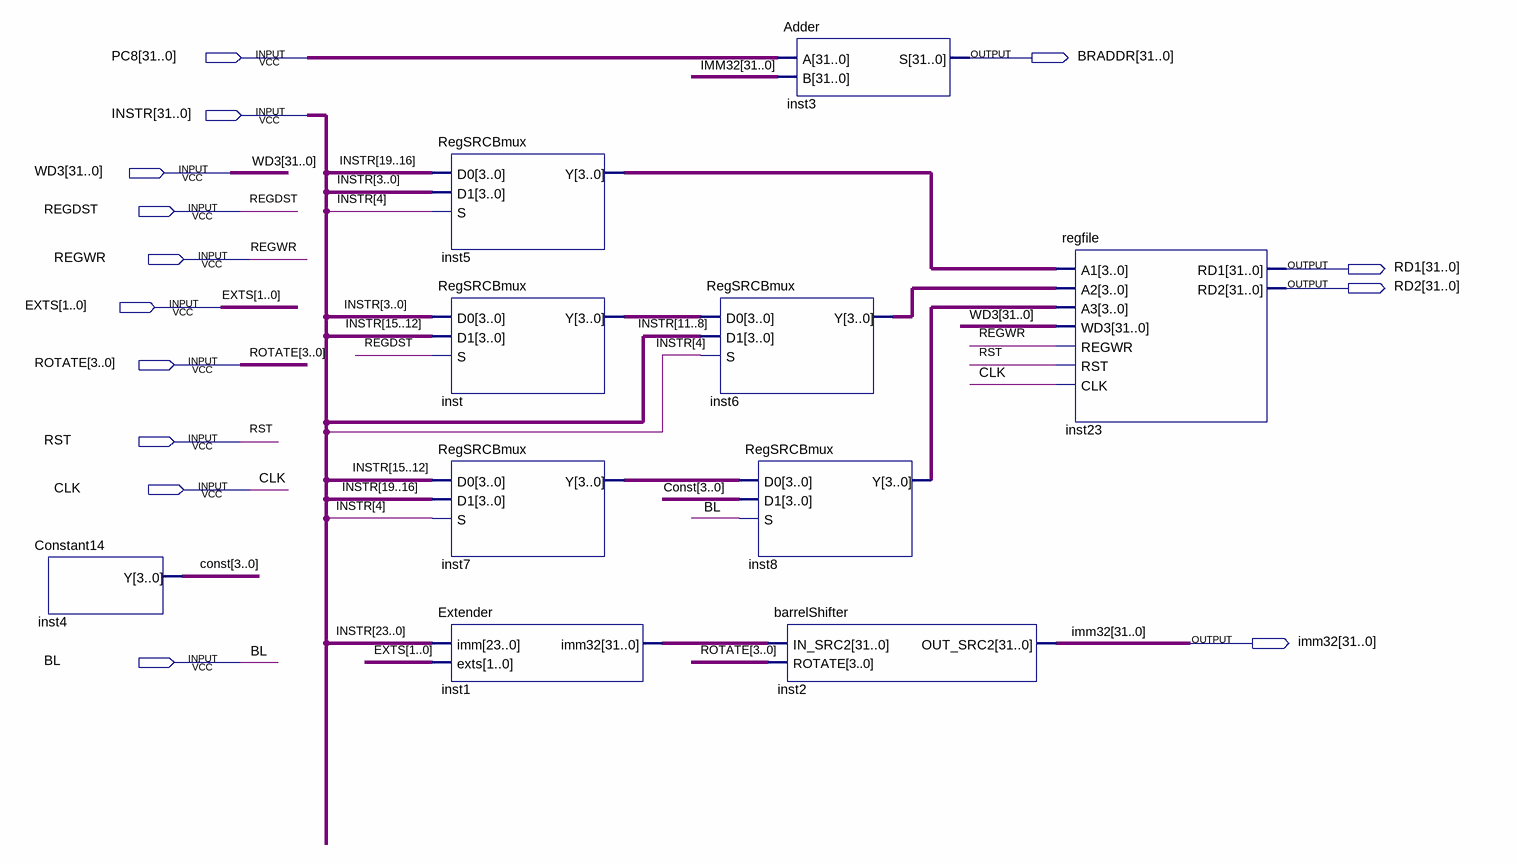
[diagram p0: schematic sheet]
// Quartus schematic Decode.bdf as structural Verilog: 10 symbols, 14 pins
module Decode (
  input  [31:0] PC8,
  input  [31:0] INSTR,
  input  [31:0] WD3,
  input  REGDST,
  input  REGWR,
  input  [1:0] EXTS,
  input  [3:0] ROTATE,
  input  RST,
  input  CLK,
  input  BL,
  output [31:0] BRADDR,
  output [31:0] RD1,
  output [31:0] RD2,
  output [31:0] imm32
);

  wire [3:0] \const , inst5_y, inst6_y, inst7_y, inst8_y, inst_y;
  wire [31:0] inst1_imm32;

  Constant14 inst4 (.Y(\const ));
  RegSRCBmux inst5 (.D0(INSTR[19:16]), .D1(INSTR[3:0]), .S(INSTR[4]), .Y(inst5_y));
  RegSRCBmux inst (.D0(INSTR[3:0]), .D1(INSTR[15:12]), .S(REGDST), .Y(inst_y));
  RegSRCBmux inst7 (.D0(INSTR[15:12]), .D1(INSTR[19:16]), .S(INSTR[4]), .Y(inst7_y));
  Extender inst1 (.imm(INSTR[23:0]), .exts(EXTS), .imm32(inst1_imm32));
  RegSRCBmux inst6 (.D0(inst_y), .D1(INSTR[11:8]), .S(INSTR[4]), .Y(inst6_y));
  RegSRCBmux inst8 (.D0(inst7_y), .D1(\const ), .S(BL), .Y(inst8_y));
  Adder inst3 (.A(PC8), .B(imm32), .S(BRADDR));
  barrelShifter inst2 (.IN_SRC2(inst1_imm32), .ROTATE(ROTATE), .OUT_SRC2(imm32));
  regfile inst23 (
    .A1(inst5_y), .A2(inst6_y), .A3(inst8_y), .WD3(WD3), .REGWR(REGWR), .RST(RST), .CLK(CLK), .RD1(RD1),
    .RD2(RD2));
endmodule
